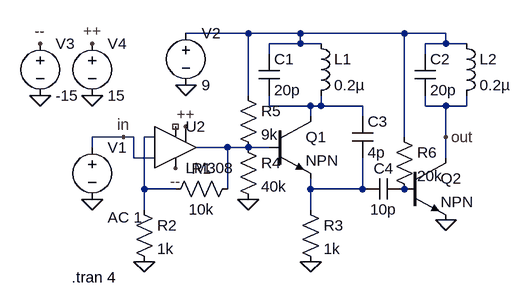
[diagram p0: schematic rf-tx.asc]
rf-tx.asc, the LTspice schematic file:
Version 4
SHEET 1 880 680
WIRE 208 -32 112 -32
WIRE 288 -32 208 -32
WIRE 448 -32 288 -32
WIRE 512 -32 448 -32
WIRE 288 -16 288 -32
WIRE 288 -16 240 -16
WIRE 320 -16 288 -16
WIRE 512 -16 512 -32
WIRE 512 -16 480 -16
WIRE 544 -16 512 -16
WIRE 240 0 240 -16
WIRE 480 0 480 -16
WIRE 208 64 208 -32
WIRE 240 80 240 64
WIRE 304 80 240 80
WIRE 320 80 320 64
WIRE 320 80 304 80
WIRE 384 80 320 80
WIRE 480 80 480 64
WIRE 512 80 480 80
WIRE 544 80 544 64
WIRE 544 80 512 80
WIRE 304 96 304 80
WIRE 384 96 384 80
WIRE 16 128 -32 128
WIRE 32 128 16 128
WIRE 64 128 48 128
WIRE 448 128 448 -32
WIRE 512 128 512 80
WIRE -32 144 -32 128
WIRE 176 144 128 144
WIRE 208 144 176 144
WIRE 240 144 208 144
WIRE 32 160 32 128
WIRE 64 160 32 160
WIRE 512 160 512 128
WIRE 48 208 48 128
WIRE 96 208 48 208
WIRE 176 208 176 144
WIRE 304 208 304 192
WIRE 384 208 384 160
WIRE 384 208 304 208
WIRE 48 240 48 208
WIRE 304 240 304 208
FLAG 512 256 0
FLAG 304 320 0
FLAG 48 320 0
FLAG 112 48 0
FLAG -32 224 0
FLAG 512 128 out
FLAG 16 128 in
FLAG 208 224 0
FLAG -112 64 0
FLAG -32 64 0
FLAG -32 -16 ++
FLAG -112 -16 --
FLAG 112 112 ++
FLAG 96 176 --
SYMBOL npn 240 96 R0
SYMATTR InstName Q1
SYMBOL npn 448 160 R0
SYMATTR InstName Q2
SYMBOL cap 224 0 R0
SYMATTR InstName C1
SYMATTR Value 20p
SYMBOL cap 464 0 R0
SYMATTR InstName C2
SYMATTR Value 20p
SYMBOL ind 304 -32 R0
SYMATTR InstName L1
SYMATTR Value 0.2µ
SYMBOL ind 528 -32 R0
SYMATTR InstName L2
SYMATTR Value 0.2µ
SYMBOL cap 368 96 R0
SYMATTR InstName C3
SYMATTR Value 4p
SYMBOL cap 448 192 R90
WINDOW 0 0 32 VBottom 2
WINDOW 3 32 32 VTop 2
SYMATTR InstName C4
SYMATTR Value 10p
SYMBOL res 192 192 R90
WINDOW 0 0 56 VBottom 2
WINDOW 3 32 56 VTop 2
SYMATTR InstName R1
SYMATTR Value 10k
SYMBOL res 32 224 R0
SYMATTR InstName R2
SYMATTR Value 1k
SYMBOL res 288 224 R0
SYMATTR InstName R3
SYMATTR Value 1k
SYMBOL voltage -32 128 R0
WINDOW 123 24 124 Left 2
WINDOW 39 0 0 Left 0
SYMATTR Value2 AC 1
SYMATTR InstName V1
SYMATTR Value ""
SYMBOL voltage 112 -48 R0
WINDOW 123 0 0 Left 0
WINDOW 39 0 0 Left 0
SYMATTR InstName V2
SYMATTR Value 9
SYMBOL res 192 128 R0
SYMATTR InstName R4
SYMATTR Value 40k
SYMBOL res 192 48 R0
SYMATTR InstName R5
SYMATTR Value 9k
SYMBOL res 432 112 R0
SYMATTR InstName R6
SYMATTR Value 20k
SYMBOL voltage -112 -32 R0
WINDOW 123 0 0 Left 0
WINDOW 39 0 0 Left 0
SYMATTR InstName V3
SYMATTR Value -15
SYMBOL voltage -32 -32 R0
WINDOW 123 0 0 Left 0
WINDOW 39 0 0 Left 0
SYMATTR InstName V4
SYMATTR Value 15
SYMBOL OpAmps\\LM308 96 80 R0
SYMATTR InstName U2
TEXT -64 344 Left 2 !.tran 4

The netlist it stands for:
* rf-tx.asc
Q1 N002 N004 N005 0 NPN
Q2 out P001 0 0 NPN
C1 N001 N002 20p
C2 N001 out 20p
L1 N001 N002 0.2µ
L2 N001 out 0.2µ
C3 N002 N005 4p
C4 P001 N005 10p
R1 N004 N003 10k
R2 N003 0 1k
R3 N005 0 1k
V1 in 0 AC 1
V2 N001 0 9
R4 N004 0 40k
R5 N001 N004 9k
R6 N001 P001 20k
V3 -- 0 -15
V4 ++ 0 15
XU2 in N003 ++ -- N004 NC_01 NC_02 LT1008
.model NPN NPN
.model PNP PNP
.lib standard.bjt
.tran 4
.lib LTC.lib
.backanno
.end